# EAGLE design demo (EAGLE 7.2.0)
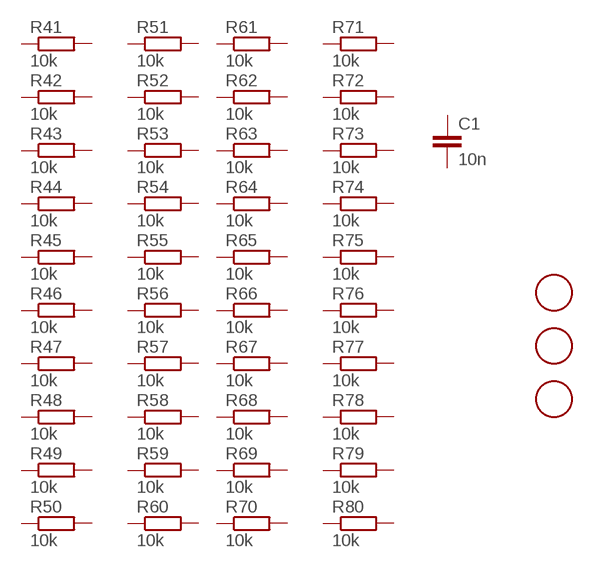
[diagram p0: schematic, sheet 1]

## Parts
C1  10n  C-EUC0402K  [C0402K]
R41  10k  R-EU_R0805  [R0805]
R42  10k  R-EU_R0805  [R0805]
R43  10k  R-EU_R0805  [R0805]
R44  10k  R-EU_R0805  [R0805]
R45  10k  R-EU_R0805  [R0805]
R46  10k  R-EU_R0805  [R0805]
R47  10k  R-EU_R0805  [R0805]
R48  10k  R-EU_R0805  [R0805]
R49  10k  R-EU_R0805  [R0805]
R50  10k  R-EU_R0805  [R0805]
R51  10k  R-EU_R0805  [R0805]
R52  10k  R-EU_R0805  [R0805]
R53  10k  R-EU_R0805  [R0805]
R54  10k  R-EU_R0805  [R0805]
R55  10k  R-EU_R0805  [R0805]
R56  10k  R-EU_R0805  [R0805]
R57  10k  R-EU_R0805  [R0805]
R58  10k  R-EU_R0805  [R0805]
R59  10k  R-EU_R0805  [R0805]
R60  10k  R-EU_R0805  [R0805]
R61  10k  R-EU_R0805  [R0805]
R62  10k  R-EU_R0805  [R0805]
R63  10k  R-EU_R0805  [R0805]
R64  10k  R-EU_R0805  [R0805]
R65  10k  R-EU_R0805  [R0805]
R66  10k  R-EU_R0805  [R0805]
R67  10k  R-EU_R0805  [R0805]
R68  10k  R-EU_R0805  [R0805]
R69  10k  R-EU_R0805  [R0805]
R70  10k  R-EU_R0805  [R0805]
R71  10k  R-EU_R0805  [R0805]
R72  10k  R-EU_R0805  [R0805]
R73  10k  R-EU_R0805  [R0805]
R74  10k  R-EU_R0805  [R0805]
R75  10k  R-EU_R0805  [R0805]
R76  10k  R-EU_R0805  [R0805]
R77  10k  R-EU_R0805  [R0805]
R78  10k  R-EU_R0805  [R0805]
R79  10k  R-EU_R0805  [R0805]
R80  10k  R-EU_R0805  [R0805]
U$1  FIDUCIAL  [FIDUCIAL_1MM]
U$2  FIDUCIAL  [FIDUCIAL_1MM]
U$3  FIDUCIAL  [FIDUCIAL_1MM]
Unconnected: C1.1 C1.2 R41.1 R41.2 R42.1 R42.2 R43.1 R43.2 R44.1 R44.2 R45.1 R45.2 R46.1 R46.2 R47.1 R47.2 R48.1 R48.2 R49.1 R49.2 R50.1 R50.2 R51.1 R51.2 R52.1 R52.2 R53.1 R53.2 R54.1 R54.2 R55.1 R55.2 R56.1 R56.2 R57.1 R57.2 R58.1 R58.2 R59.1 R59.2 R60.1 R60.2 R61.1 R61.2 R62.1 R62.2 R63.1 R63.2 R64.1 R64.2 R65.1 R65.2 R66.1 R66.2 R67.1 R67.2 R68.1 R68.2 R69.1 R69.2 R70.1 R70.2 R71.1 R71.2 R72.1 R72.2 R73.1 R73.2 R74.1 R74.2 R75.1 R75.2 R76.1 R76.2 R77.1 R77.2 R78.1 R78.2 R79.1 R79.2 R80.1 R80.2

## Library data of the parts
C1 = rcl:C-EU: CAPACITOR, European symbol
R41-R80 = rcl:R-EU_: RESISTOR, European symbol
U$1-U$3 = adafruit:FIDUCIAL: For use by pick and place machines to calibrate the vision/machine, 1mm By microbuilder.eu

## Board
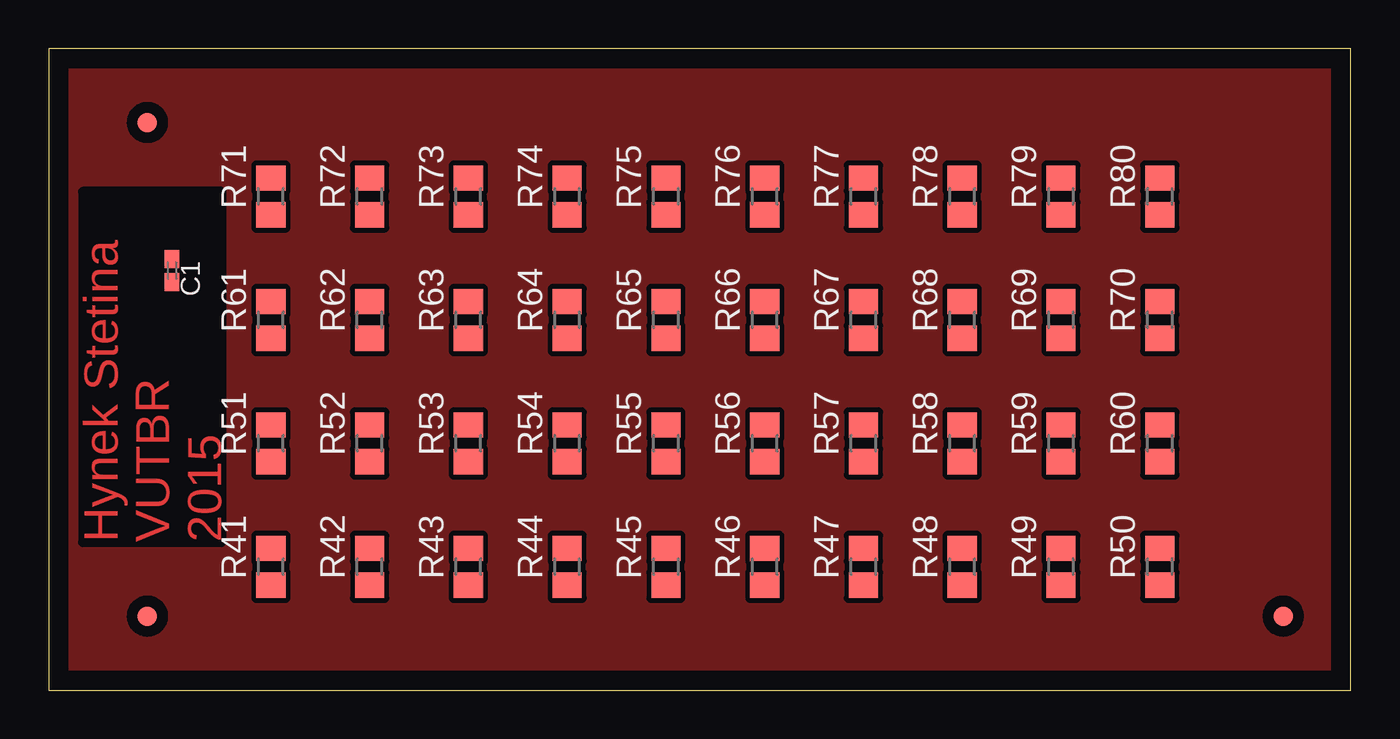
[diagram p1: board, top side]

Size 66.98 x 33.01 mm. Coordinates in mm from the lower left corner, seen from the top.
Outline: 0,0 66.98,0 66.98,33.01 0,33.01 0,0
Copper layers (1*16): Top 0.035mm / dielectric 1.5mm / Bottom 0.035mm
Design rules "default *": minimum track width 10mil, minimum drill 24mil, track to track 10mil, track to pad 10mil, pad to pad 10mil, via to via 10mil, smd to smd 10mil, copper to edge 40mil, drill to drill 8mil, minimum pad ring 10mil, minimum via ring 8mil, stop-mask expansion 4mil, vias tented up to drill 0mil, thermal gap 10mil

### Footprints (pad centres in the part's own frame; a part is rotated, then mirrored left to right if it is on the bottom)
C0402K = smd 0.925 x 0.74: 1 -0.6,0; 2 0.6,0
R0805 = smd 1.3 x 1.5: 1 -0.95,0; 2 0.95,0
FIDUCIAL_1MM = smd 1 x 1: 1 0,0

### Placement (x,y rotation side)
C1  6.35,21.59 270 top
R41  11.43,6.35 90 top
R42  16.51,6.35 90 top
R43  21.59,6.35 90 top
R44  26.67,6.35 90 top
R45  31.75,6.35 90 top
R46  36.83,6.35 90 top
R47  41.91,6.35 90 top
R48  46.99,6.35 90 top
R49  52.07,6.35 90 top
R50  57.15,6.35 90 top
R51  11.43,12.7 90 top
R52  16.51,12.7 90 top
R53  21.59,12.7 90 top
R54  26.67,12.7 90 top
R55  31.75,12.7 90 top
R56  36.83,12.7 90 top
R57  41.91,12.7 90 top
R58  46.99,12.7 90 top
R59  52.07,12.7 90 top
R60  57.15,12.7 90 top
R61  11.43,19.05 90 top
R62  16.51,19.05 90 top
R63  21.59,19.05 90 top
R64  26.67,19.05 90 top
R65  31.75,19.05 90 top
R66  36.83,19.05 90 top
R67  41.91,19.05 90 top
R68  46.99,19.05 90 top
R69  52.07,19.05 90 top
R70  57.15,19.05 90 top
R71  11.43,25.4 90 top
R72  16.51,25.4 90 top
R73  21.59,25.4 90 top
R74  26.67,25.4 90 top
R75  31.75,25.4 90 top
R76  36.83,25.4 90 top
R77  41.91,25.4 90 top
R78  46.99,25.4 90 top
R79  52.07,25.4 90 top
R80  57.15,25.4 90 top
U$1  5.08,3.81 0 top
U$2  5.08,29.21 0 top
U$3  63.5,3.81 0 top

### Tracks (layer width: path | path; a pad name or v marks a point on that pad's centre or on a via)
N$1
  pour Top: 0,0 67.31,0 67.31,33.02 0,33.02

### Text on the board
Top: Hynek Stetina / VUTBR / 2015